# EAGLE design imu300_combo_board-v10 (EAGLE 5.11)
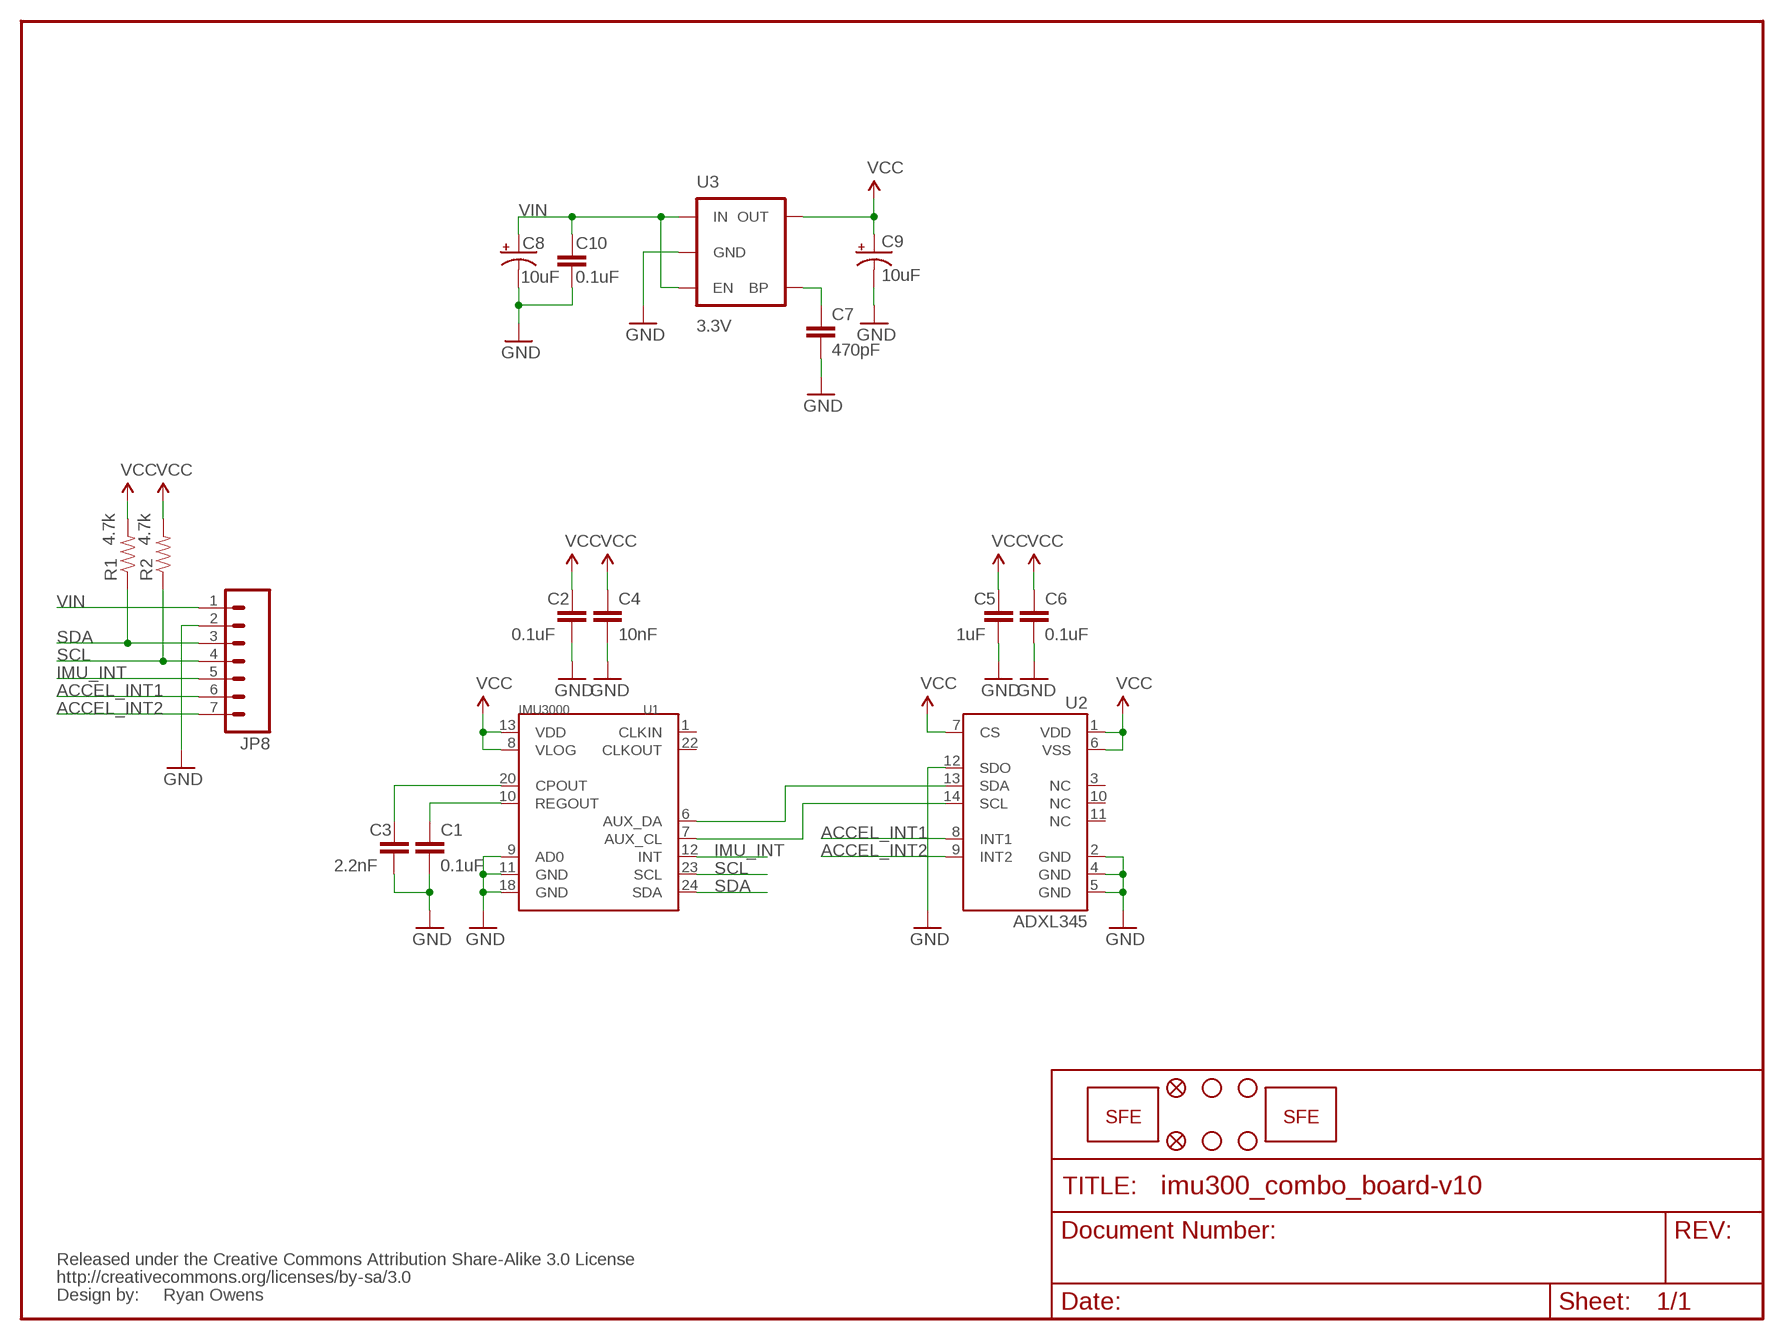
[diagram p0: schematic, sheet 1]

## Parts
C1  0.1uF  CAP0603-CAP  [0603-CAP]
C2  0.1uF  CAP0603-CAP  [0603-CAP]
C3  2.2nF  CAP0603-CAP  [0603-CAP]
C4  10nF  CAP0603-CAP  [0603-CAP]
C5  1uF  CAP0603-CAP  [0603-CAP]
C6  0.1uF  CAP0603-CAP  [0603-CAP]
C7  470pF  CAP0603-CAP  [0603-CAP]
C8  10uF  CAP_POL1206  [EIA3216]
C9  10uF  CAP_POL1206  [EIA3216]
C10  0.1uF  CAP0603-CAP  [0603-CAP]
JP1  LOGO-SFENEW  [SFE-NEW-WEBLOGO]
JP2  FIDUCIAL1X2  [FIDUCIAL-1X2]
JP3  FIDUCIAL1X2  [FIDUCIAL-1X2]
JP4  STAND-OFF  [STAND-OFF]
JP5  STAND-OFF  [STAND-OFF]
JP6  STAND-OFF  [STAND-OFF]
JP7  STAND-OFF  [STAND-OFF]
JP8  M07  [1X07]
JP9  LOGO-SFESK  [SFE-LOGO-FLAME]
R1  4.7k  RESISTOR0603-RES  [0603-RES]
R2  4.7k  RESISTOR0603-RES  [0603-RES]
U1  IMU3000  [QFN-24]
U2  ADXL345  [LGA14]
U3  3.3V  V_REG_LDOSMD  [SOT23-5]
U$1  CREATIVE_COMMONS  [CREATIVE_COMMONS]

## Nets
ACCEL_INT1: JP8.6 U2.8(INT1)
ACCEL_INT2: JP8.7 U2.9(INT2)
GND: C1.2 C2.2 C3.2 C4.2 C5.2 C6.2 C7.2 C8.C(-) C9.C(-) C10.2 JP8.2 U1.9(AD0) U1.11(GND) U1.18(GND) U2.2(GND) U2.4(GND) U2.5(GND) U2.12(SDO) U3.2(GND)
IMU_INT: JP8.5 U1.12(INT)
N$1: U1.6(AUX_DA) U2.13(SDA)
N$2: C3.1 U1.20(CPOUT)
N$3: U1.7(AUX_CL) U2.14(SCL)
N$4: C1.1 U1.10(REGOUT)
N$6: C7.1 U3.4(BP)
SCL: JP8.4 R2.1 U1.23(SCL)
SDA: JP8.3 R1.1 U1.24(SDA)
VCC: C2.1 C4.1 C5.1 C6.1 C9.A(+) R1.2 R2.2 U1.8(VLOG) U1.13(VDD) U2.1(VDD) U2.6(VSS) U2.7(CS) U3.5(OUT)
VIN: C8.A(+) C10.1 JP8.1 U3.1(IN) U3.3(EN)
Unconnected: U1.1(CLKIN) U1.22(CLKOUT) U2.3(NC) U2.10(NC) U2.11(NC)

## Notes on the sheet
- Ryan Owens

## Library data of the parts
C1-C7 C10 = SparkFun:CAP: Capacitor Standard 0603 ceramic capacitor, and 0.1" leaded capacitor.
C8 C9 = SparkFun:CAP_POL: Capacitor Polarized These are standard SMD and PTH capacitors. Normally 10uF, 47uF, and 100uF in electrolytic and tantalum varieties. Always verify the external diameter of the through hole cap, it varies with capacity, voltage, and manufacturer. The EIA devices should be standard.
JP1 JP9 = SparkFun:LOGO-SFE: Spark Fun Electronics PCB Logo This is the standard Spark Fun Electronics PCB logo.
JP2 JP3 = SparkFun:FIDUCIAL: Fiducial Alignment Points Various fiducial points for machine vision alignment.
JP4-JP7 = SparkFun:STAND-OFF: Stand Off This is the mechanical footprint for a #4 phillips button head screw. Use the keepout ring to avoid running the screw head into surrounding components. SKU : PRT-00447
JP8 = SparkFun:M07: Header 7 Standard 7-pin 0.1" header. Use with straight break away headers (SKU : PRT-00116), right angle break away headers (PRT-00553), swiss pins (PRT-00743), machine pins (PRT-00117), and female headers (PRT-00115). NOTES ON THE VARIANTS LOCK and LOCK_LONGPADS... This footprint was designed to help hold the alignment of a through-hole component (i.e. 7-pin header) while soldering it into place. You may notice that each hole has been shifted either up or down by 0.005 of an inch from it's more standard position (which is usually a perfectly straight line). This slight alteration caused the pins (the squares in the middle) to touch the edges of the holes. Because they are alternating, it causes a "brace" to hold the header in place. 0.005 has proven to be the perfect amount of "off-center" position when using our standard breakaway headers. Although looks a little odd when you look at the bare footprint, once you have a header in there, the alteration is very hard to notice. Also, if you push a header all the way into place, it is covered up entirely on the bottom side. This idea of altering the position of holes to aid alignment will be further integrated into the Sparkfun Library for other footprints. It can help hold any component with 3 or more connection pins.
R1 R2 = SparkFun:RESISTOR: Resistor Basic schematic elements and footprints for 0603, 1206, and PTH resistors.
U1 = SparkFun:IMU3000
U2 = SparkFun:ADXL345
U3 = SparkFun:V_REG_LDO: Voltage Regulator LDO Standard 150mA LDO voltage regulator in SOT-23 layout. Micrel part MIC5205. BP (by-pass) pin is used to lower output noise with 470pF cap.
U$1 = SparkFun:CREATIVE_COMMONS

## Board
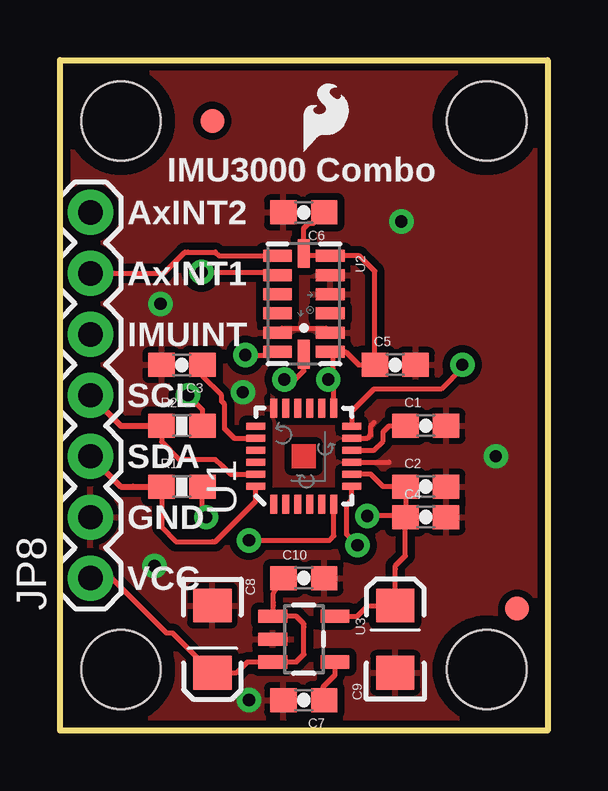
[diagram p1: board, top side]
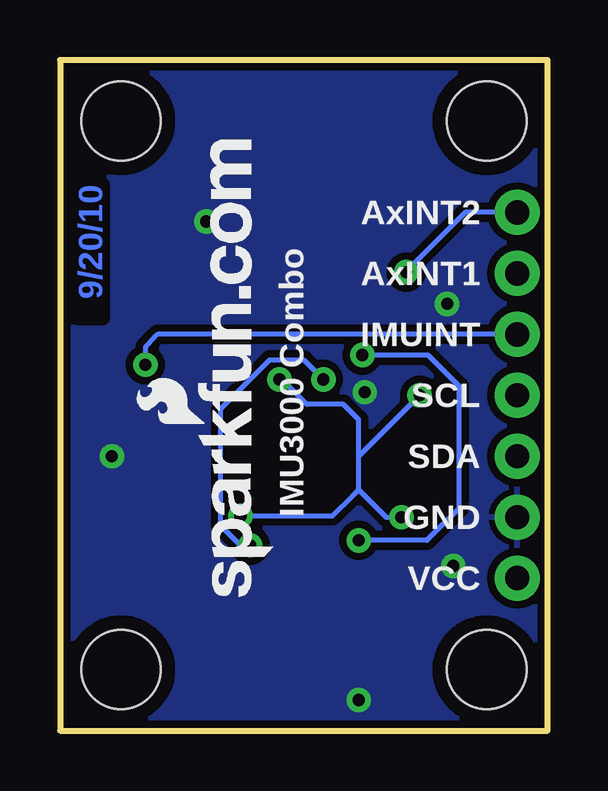
[diagram p2: board, bottom side, seen from below]

Size 20.32 x 27.94 mm. Coordinates in mm from the lower left corner, seen from the top.
Outline: 0,0 0,27.94 20.32,27.94 20.32,0 0,0
Copper layers (1*16): Top 0.035mm / dielectric 1.5mm / Bottom 0.035mm
Design rules "SparkFun *": minimum track width 8mil, minimum drill 20mil, track to track 8mil, track to pad 8mil, pad to pad 6mil, via to via 8mil, smd to smd 8mil, copper to edge 8mil, drill to drill 8mil, minimum pad ring 12mil, minimum via ring 10mil, stop-mask expansion 4mil, vias tented up to drill 20mil, thermal gap 10mil

### Footprints (pad centres in the part's own frame; a part is rotated, then mirrored left to right if it is on the bottom)
0603-CAP = smd 1.1 x 1: 1 -0.85,0; 2 0.85,0
EIA3216 = smd 1.4 x 1.6: A 1.4,0; C -1.4,0
FIDUCIAL-1X2 = smd 1 x 1: 1 0,0
STAND-OFF = hole 3.302: 0,0
1X07 = drill 1.016 pad 1.88 round: 1 0,0; 2 2.54,0; 3 5.08,0; 4 7.62,0; 5 10.16,0; 6 12.7,0; 7 15.24,0
0603-RES = smd 1.1 x 1: 1 -0.85,0; 2 0.85,0
QFN-24 = smd 0.8 x 0.3: 1 -2,1.25; 2 -2,0.75; 3 -2,0.25; 4 -2,-0.25; 5 -2,-0.75; 6 -2,-1.25; 13 2,-1.25; 14 2,-0.75; 15 2,-0.25; 16 2,0.25; 17 2,0.75; 18 2,1.25 | smd 0.3 x 0.8: 7 -1.25,-2; 8 -0.75,-2; 9 -0.25,-2; 10 0.25,-2; 11 0.75,-2; 12 1.25,-2; 19 1.25,2; 20 0.75,2; 21 0.25,2; 22 -0.25,2; 23 -0.75,2; 24 -1.25,2
LGA14 = smd 0.5 x 1.2: 1 2,1.1; 2 1.2,1.1; 3 0.4,1.1; 4 -0.4,1.1; 5 -1.2,1.1; 6 -2,1.1; 8 -2,-1.1; 9 -1.2,-1.1; 10 -0.4,-1.1; 11 0.4,-1.1; 12 1.2,-1.1; 13 2,-1.1 | smd 1.2 x 0.5: 7 -2.1,0; 14 2.1,0
SOT23-5 = smd 0.55 x 1.2: 1 -0.95,-1.3; 2 0,-1.3; 3 0.95,-1.3; 4 0.95,1.3; 5 -0.95,1.3

### Placement (x,y rotation side)
C1  15.24,12.7 0 top
C2  15.24,10.16 0 top
C3  5.08,15.24 180 top
C4  15.24,8.89 0 top
C5  13.97,15.24 0 top
C6  10.16,21.59 180 top
C7  10.16,1.27 180 top
C8  6.35,3.81 270 top
C9  13.97,3.81 90 top
C10  10.16,6.35 0 top
JP1  11.43,5.59 90 bottom
JP2  19.05,5.08 0 top
JP3  6.35,25.4 0 top
JP4  2.54,2.54 0 top
JP5  2.54,25.4 0 top
JP6  17.78,2.54 0 top
JP7  17.78,25.4 0 top
JP8  1.27,6.35 90 top
JP9  10.16,24.13 0 top
R1  5.08,10.16 0 top
R2  5.08,12.7 0 top
U1  10.16,11.43 90 top
U2  10.16,17.78 270 top
U3  10.16,3.81 270 top
U$1  -3.81,-39.37 0 top  (outside the outline)

### Tracks (layer width: path | path; a pad name or v marks a point on that pad's centre or on a via)
ACCEL_INT1
  Top 0.203: JP8.6 4.32,19.05 5.21,19.94 5.33,19.94 6.48,19.94 6.64,19.78 U2.8
ACCEL_INT2  (via drill 0.51)
  Top 0.203: v5.89,19.1 8.53,19.1 U2.9
  Bottom 0.203: v5.89,19.1 5.89,19.13 5.84,19.18 3.43,21.59 JP8.7
GND  (via drill 0.51)
  Top 0.203: U1.9 13.71,11.18 13.72,11.18 | U1.11 12.81,12.18 12.95,12.32 12.95,12.7 13.08,12.83 | U2.12 9.24,16.76 10.16,16.76 10.29,16.76 11.08,16.76 U2.2
  other vias: 3.94,6.86 18.16,11.43 14.22,21.21 4.19,17.78 7.87,1.27 7.62,14.1
  pour Bottom (isolate 0.305): 0,0 0,27.94 20.32,27.94 20.32,0
  pour Top (isolate 0.305): 0,0 0,27.94 20.32,27.94 20.32,0
IMU_INT  (via drill 0.51)
  Top 0.203: U1.12 12.16,13.3 12.7,13.84 13.08,14.22 15.88,14.22 16.76,15.11 v16.76,15.24
  Bottom 0.203: v16.76,15.24 16.76,16 16.38,16.38 16.26,16.51 JP8.5
N$1  (via drill 0.51)
  Top 0.203: v7.72,15.65 8.53,15.65 U2.13 | v7.87,7.92 11.23,7.92 11.3,8 11.41,8.11 U1.6
  Bottom 0.203: v7.87,7.92 8,7.92 5.03,7.92 3.68,9.27 3.68,14.35 4.83,15.49 4.98,15.65 v7.72,15.65
N$2
  Top 0.203: U1.20 7.25,12.18 6.99,12.45 6.86,12.57 6.86,12.7 6.86,13.59 6.73,13.72 6.73,13.97 5.93,14.77 C3.1
N$3  (via drill 0.51)
  Top 0.203: v12.39,7.72 11.99,8.13 11.94,8.18 11.94,8.26 11.94,9.4 12.16,9.62 U1.7 | U2.14 10.16,14.99 9.91,14.73 9.8,14.63 v9.35,14.63
  Bottom 0.203: v12.39,7.72 12.8,7.72 13.61,8.53 13.61,13.41 11.58,15.44 10.16,15.44 v9.35,14.63
N$4
  Top 0.203: U1.10 13.08,11.68 13.46,12.06 13.46,12.45 13.72,12.7 C1.1
N$6
  Top 0.203: C7.1 10.97,1.63 10.97,1.83 11.43,2.29 11.46,2.32 U3.4
SCL
  Top 0.203: U1.23 7.1,10.68 6.86,10.92 6.73,11.05 6.48,11.3 4.95,11.3 4.23,12.03 R2.1
  Top 0.254: JP8.4 2.54,12.7 3.05,12.7 3.17,12.7 R2.1
SDA
  Top 0.203: R1.1 4.23,8.47 4.83,7.87 6.35,7.87 6.48,7.87 8.13,9.53 8.16,9.56 U1.24
  Top 0.254: JP8.3 2.54,10.16 3.05,10.16 R1.1
VCC  (via drill 0.51)
  Top 0.203: C4.1 14.43,9.35 14.43,9.75 C2.1 14.35,10.16 13.46,10.16 12.94,10.68 U1.8 | C6.1 10.57,21.13 10.36,21.13 10.16,20.93 10.16,20.32 U2.7 10.16,19.81 10.19,19.78 U2.6 12.48,19.78 12.83,19.43 12.95,19.3 13.12,19.14 C5.1 12.45,15.24 12.06,15.62 11.91,15.78 U2.1 11.38,15.65 11.38,15.44 11.38,14.63 | 11.38,14.63 11.38,13.82 U1.13 | v11.18,14.63 11.38,14.63 | v12.8,8.94 14.02,8.94 C4.1 | U3.5 12.38,4.76 12.7,5.08 12.83,5.21 C9.A 13.97,6.73 13.97,6.86 14.39,7.28 C4.1 | R1.2 5.93,9.06 v6.1,8.89 | R2.2 5.93,13.37 v5.33,13.97
  Bottom 0.203: v11.18,14.63 11.07,14.63 11.05,14.61 10.03,13.59 8.51,13.59 7.92,13.01 7.87,12.95 7.87,11.43 | v12.8,8.94 8.97,8.94 8.13,9.78 8,9.91 7.87,10.03 | 7.87,10.03 7.87,11.43 | 7.87,10.03 6.73,8.89 v6.1,8.89 | v5.33,13.97 5.71,13.59 7.87,11.43
VIN
  Top 0.203: JP8.1 2.16,6.35 4.45,4.06 4.7,4.06 C8.A 7.36,2.41 7.75,2.79 7.81,2.86 U3.3 9.85,2.86 10.16,3.17 10.16,4.32 10.16,4.45 9.85,4.76 U3.1 | C10.1 8.89,5.73 8.89,5.33 8.89,5.21 8.89,4.79
  Top 0.254: U3.1 8.89,4.79

### Text on the board
Bottom: 9/20/10
tPlace: IMU3000 Combo | AxINT2 | AxINT1 | IMUINT | SCL | SDA | GND | VCC
bPlace: AxINT2 | AxINT1 | IMUINT | SCL | SDA | GND | IMU3000 Combo | VCC